# EAGLE design layout (EAGLE 7.5.0)
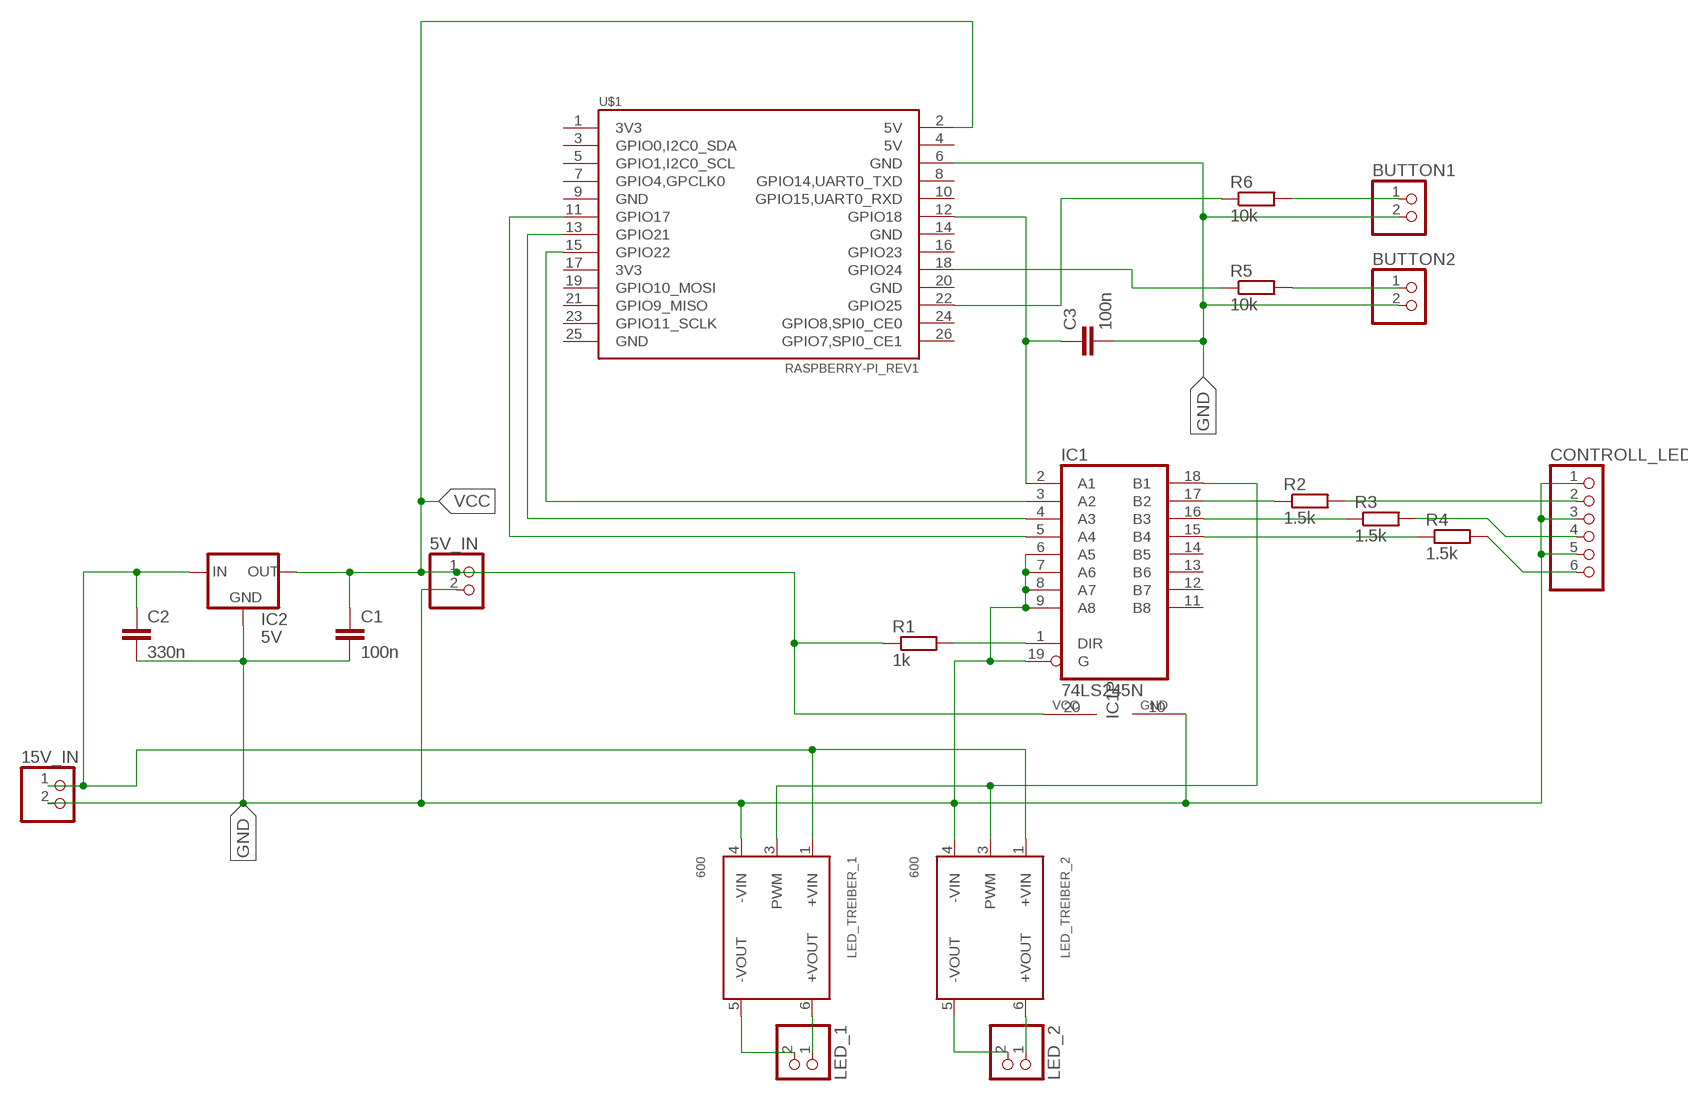
[diagram p0: schematic, sheet 1]

## Parts
5V_IN  PINHD-1X2  [1X02]
15V_IN  PINHD-1X2  [1X02]
BUTTON1  PINHD-1X2  [1X02]
BUTTON2  PINHD-1X2  [1X02]
C1  100n  C7.5/3  [C7.5B3]
C2  330n  C7.5/5  [C7.5B5]
C3  100n  C7.5/3  [C7.5B3]
CONTROLL_LED  PINHD-1X6  [1X06]
IC1  74LS245N  [DIL20]
IC2  5V  78XXS  [78XXS]
LED_1  PINHD-1X2  [1X02]
LED_2  PINHD-1X2  [1X02]
LED_TREIBER_1  600  LDD-L1  [LDD-L1]
LED_TREIBER_2  600  LDD-L1  [LDD-L1]
R1  1k  R-EU_0309/10  [0309/10]
R2  1.5k  R-EU_0309/10  [0309/10]
R3  1.5k  R-EU_0309/10  [0309/10]
R4  1.5k  R-EU_0309/10  [0309/10]
R5  10k  R-EU_0309/10  [0309/10]
R6  10k  R-EU_0309/10  [0309/10]
U$1  RASPBERRY-PI_REV1  [RASPBERRY-PI_REV1]

## Nets
GND: 5V_IN.2 15V_IN.2 BUTTON1.2 BUTTON2.2 C1.2 C2.2 C3.2 CONTROLL_LED.1 CONTROLL_LED.3 CONTROLL_LED.5 IC1.6(A5) IC1.7(A6) IC1.8(A7) IC1.9(A8) IC1.10(GND) IC1.19(G) IC2.GND LED_TREIBER_1.4(-VIN) LED_TREIBER_2.4(-VIN) U$1.6(GND)
N$1: LED_1.2 LED_TREIBER_1.5(-VOUT)
N$2: LED_1.1 LED_TREIBER_1.6(+VOUT)
N$3: LED_2.2 LED_TREIBER_2.5(-VOUT)
N$4: LED_2.1 LED_TREIBER_2.6(+VOUT)
N$5: IC1.1(DIR) R1.2
N$6: 15V_IN.1 C2.1 IC2.IN LED_TREIBER_1.1(+VIN) LED_TREIBER_2.1(+VIN)
N$7: IC1.18(B1) LED_TREIBER_1.3(PWM) LED_TREIBER_2.3(PWM)
N$8: C3.1 IC1.2(A1) U$1.12(GPIO18)
N$9: IC1.3(A2) U$1.15(GPIO22)
N$10: IC1.4(A3) U$1.13(GPIO21)
N$11: IC1.5(A4) U$1.11(GPIO17)
N$12: R5.1 U$1.18(GPIO24)
N$13: IC1.17(B2) R2.1
N$14: IC1.16(B3) R3.1
N$15: IC1.15(B4) R4.1
N$16: CONTROLL_LED.2 R2.2
N$17: CONTROLL_LED.4 R3.2
N$18: CONTROLL_LED.6 R4.2
N$19: R6.1 U$1.22(GPIO25)
N$20: BUTTON2.1 R5.2
N$21: BUTTON1.1 R6.2
VCC: 5V_IN.1 C1.1 IC1.20(VCC) IC2.OUT R1.1 U$1.2(5V)
Unconnected: IC1.11(B8) IC1.12(B7) IC1.13(B6) IC1.14(B5) U$1.1(3V3) U$1.3(GPIO0,I2C0_SDA) U$1.4(5V) U$1.5(GPIO1,I2C0_SCL) U$1.7(GPIO4,GPCLK0) U$1.8(GPIO14,UART0_TXD) U$1.9(GND) U$1.10(GPIO15,UART0_RXD) U$1.14(GND) U$1.16(GPIO23) U$1.17(3V3) U$1.19(GPIO10_MOSI) U$1.20(GND) U$1.21(GPIO9_MISO) U$1.23(GPIO11_SCLK) U$1.24(GPIO8,SPI0_CE0) U$1.25(GND) U$1.26(GPIO7,SPI0_CE1)

## Library data of the parts
5V_IN 15V_IN BUTTON1 BUTTON2 LED_1 LED_2 = pinhead:PINHD-1X2: PIN HEADER
C1-C3 = capacitor-wima:C: CAPACITOR naming: grid - package width
CONTROLL_LED = pinhead:PINHD-1X6: PIN HEADER
IC1 = adafruit:74*245: Octal BUS TRANSCEIVER, 3-state
IC2 = v-reg:78XXS: VOLTAGE REGULATOR
LED_TREIBER_1 LED_TREIBER_2 = meanwell_dcdc_v8:LDD-L1: LDD-L Constant Current: 300 - 700mA Vin : 9 - 36V Vout: 2 - 32V Cout: 300= 300mA 350= 350mA 500= 500mA 600= 600mA 700= 700mA PWM Frequency: 100Hz - 1KHz (5V / 1mA)
R1-R6 = resistor:R-EU_: RESISTOR, European symbol
U$1 = RaspberryPi:RASPBERRY-PI_REV1: Raspberry Pi Board <http://www.raspberrypi.org/> Jacques Lagnel V1.0 (beta) 2012 Mateusz Bawaj V1.1 (beta) 2012 Board dimension: Forum 3D model <http://www.raspberrypi.org/forum/general-discussion/mechanical-profile-3d-models?value=3d%20model&type=1&include=1&search=1&ret=all> The GPIO Connector (P1): http://elinux.org/RPi_Low-level_peripherals

## Board
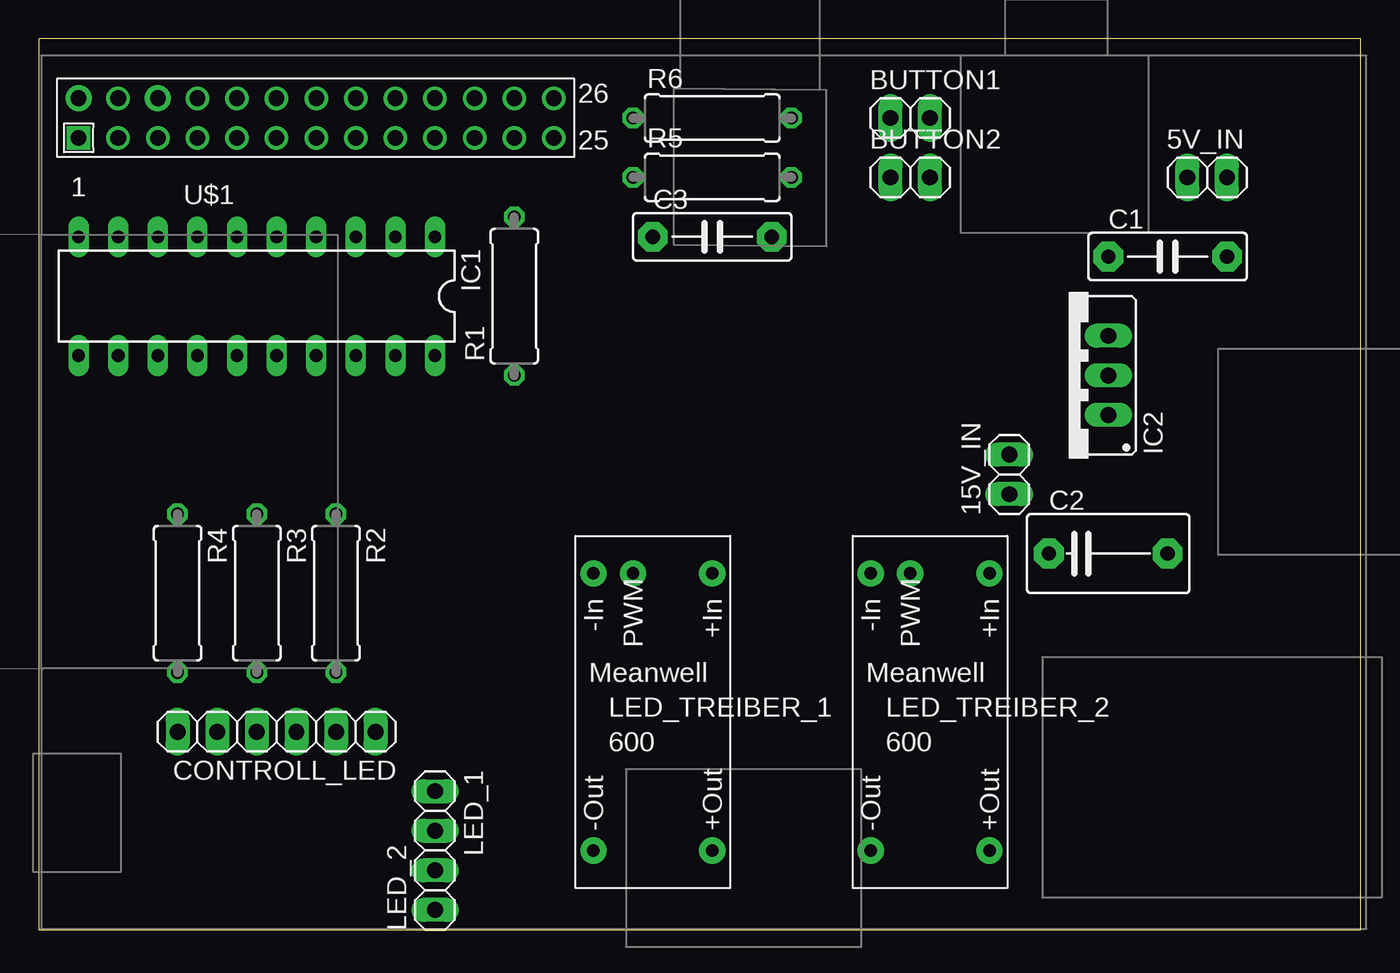
[diagram p1: board, top side]
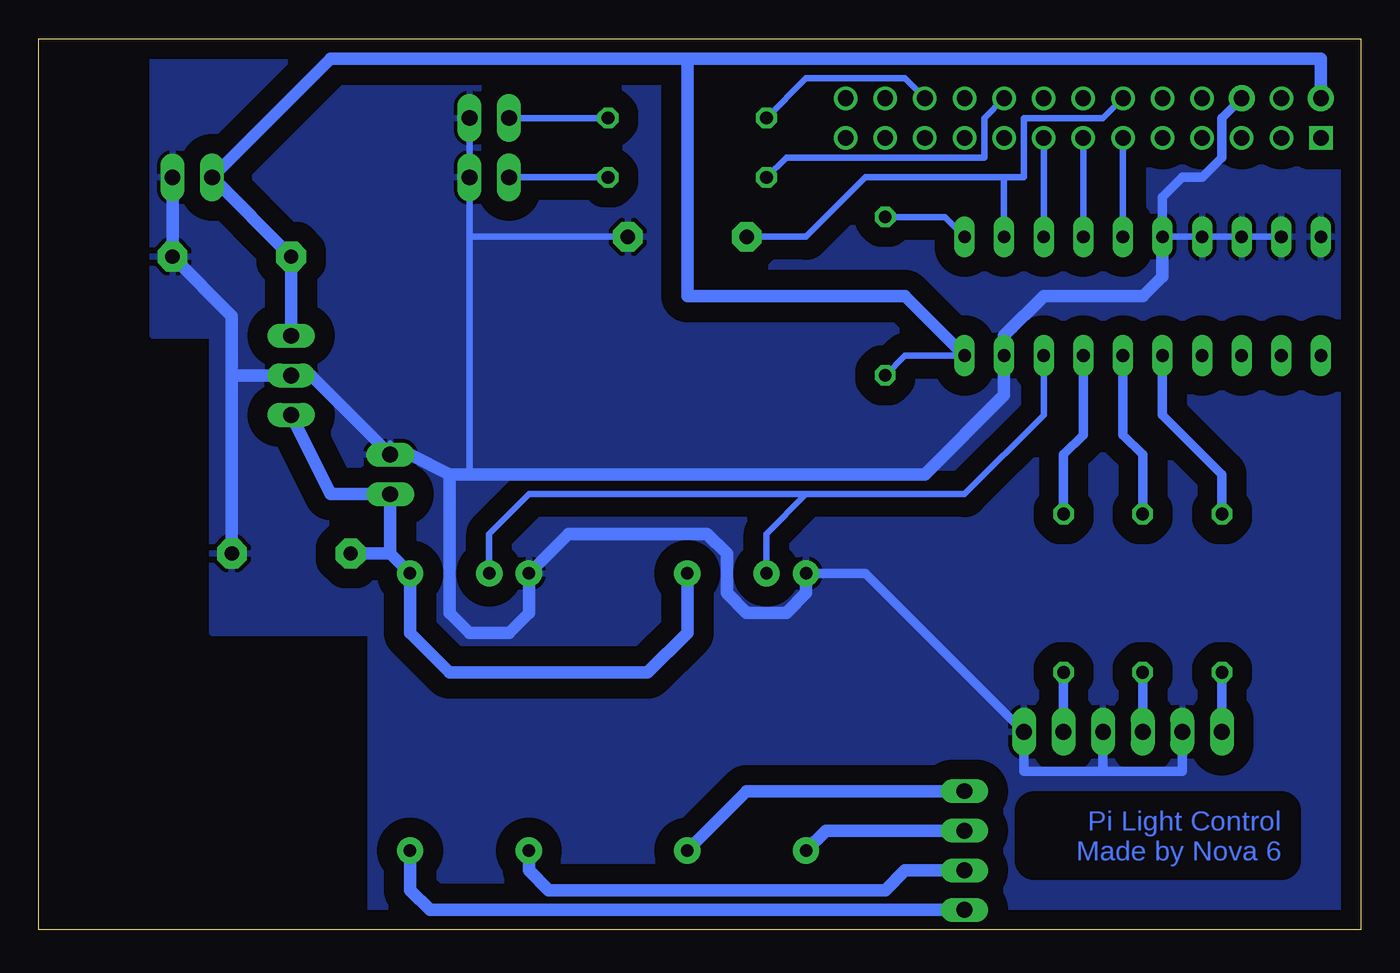
[diagram p2: board, bottom side, seen from below]

Size 84.76 x 57.14 mm. Coordinates in mm from the lower left corner, seen from the top.
Outline: 0,0 84.76,0 84.76,57.14 0,57.14 0,0
Copper layers (1*16): Top 0.035mm / dielectric 1.5mm / Bottom 0.035mm
Design rules "default": minimum track width 10mil, minimum drill 24mil, track to track 8mil, track to pad 8mil, pad to pad 8mil, via to via 8mil, smd to smd 8mil, copper to edge 40mil, drill to drill 8mil, minimum pad ring 10mil, minimum via ring 8mil, stop-mask expansion 4mil, vias tented up to drill 0mil, thermal gap 10mil

### Footprints (pad centres in the part's own frame; a part is rotated, then mirrored left to right if it is on the bottom)
1X02 = drill 1.016 long: 1 -1.27,0; 2 1.27,0
C7.5B3 = drill 0.914 pad 1.905 octagon: 1 -3.81,0; 2 3.81,0
C7.5B5 = drill 0.914 pad 1.905 octagon: 1 -3.81,0; 2 3.81,0
1X06 = drill 1.016 long: 1 -6.35,0; 2 -3.81,0; 3 -1.27,0; 4 1.27,0; 5 3.81,0; 6 6.35,0
DIL20 = drill 0.813 long: 1 -11.43,-3.81; 2 -8.89,-3.81; 3 -6.35,-3.81; 4 -3.81,-3.81; 5 -1.27,-3.81; 6 1.27,-3.81; 7 3.81,-3.81; 8 6.35,-3.81; 9 8.89,-3.81; 10 11.43,-3.81; 11 11.43,3.81; 12 8.89,3.81; 13 6.35,3.81; 14 3.81,3.81; 15 1.27,3.81; 16 -1.27,3.81; 17 -3.81,3.81; 18 -6.35,3.81; 19 -8.89,3.81; 20 -11.43,3.81
78XXS = drill 1.016 long: GND 0,-2.54; IN -2.54,-2.54; OUT 2.54,-2.54
LDD-L1 = drill 0.8 pad 1.676: 1 3.81,8.89; 3 -1.27,8.89; 4 -3.81,8.89; 5 -3.81,-8.89; 6 3.81,-8.89
0309/10 = drill 0.813 octagon: 1 -5.08,0; 2 5.08,0
RASPBERRY-PI_REV1 = drill 1 square: 1 -41.91,21.59 | drill 1 pad 1.676: 2 -41.91,24.13; 6 -36.83,24.13 | drill 1: 3 -39.37,21.59; 4 -39.37,24.13; 5 -36.83,21.59; 7 -34.29,21.59; 8 -34.29,24.13; 9 -31.75,21.59; 10 -31.75,24.13; 11 -29.21,21.59; 12 -29.21,24.13; 13 -26.67,21.59; 14 -26.67,24.13; 15 -24.13,21.59; 16 -24.13,24.13; 17 -21.59,21.59; 18 -21.59,24.13; 19 -19.05,21.59; 20 -19.05,24.13; 21 -16.51,21.59; 22 -16.51,24.13; 23 -13.97,21.59; 24 -13.97,24.13; 25 -11.43,21.59; 26 -11.43,24.13

### Placement (x,y rotation side)
5V_IN  74.93,48.26 0 top
15V_IN  62.23,29.21 90 top
BUTTON1  55.88,52.07 0 top
BUTTON2  55.88,48.26 0 top
C1  72.39,43.18 0 top
C2  68.58,24.13 0 top
C3  43.18,44.45 0 top
CONTROLL_LED  15.24,12.7 180 top
IC1  13.97,40.64 180 top
IC2  66.04,35.56 90 top
LED_1  25.4,7.62 270 top
LED_2  25.4,2.54 90 top
LED_TREIBER_1  39.37,13.97 0 top
LED_TREIBER_2  57.15,13.97 0 top
R1  30.48,40.64 90 top
R2  19.05,21.59 270 top
R3  13.97,21.59 270 top
R4  8.89,21.59 270 top
R5  43.18,48.26 0 top
R6  43.18,52.07 0 top
U$1  44.45,29.21 0 top

### Tracks (layer width: path | path; a pad name or v marks a point on that pad's centre or on a via)
GND
  Bottom 0.406: IC1.6 IC1.7 IC1.8 IC1.9 | BUTTON1.2 BUTTON2.2 57.15,44.45 | 62.23,31.19 15V_IN.2 | C3.2 57.15,44.45 | 57.15,44.45 57.15,29.21
  Bottom 0.61: 16.51,10.16 21.59,10.16 CONTROLL_LED.1 31.75,22.86 LED_TREIBER_1.4 | 16.51,10.16 CONTROLL_LED.3 | CONTROLL_LED.5 11.43,10.16 16.51,10.16 | U$1.6 8.89,52.07 8.89,49.53 10.16,48.26 11.43,48.26 12.7,46.99 IC1.6
  Bottom 0.813: 58.42,29.21 60.96,30.48 15V_IN.2 67.31,35.56 IC2.GND 72.39,35.56 | 72.39,35.56 C2.2 | 5V_IN.2 C1.2 72.39,39.37 72.39,35.56 | 58.42,29.21 57.15,29.21 27.94,29.21 22.86,34.29 IC1.19 22.86,38.1 20.32,40.64 13.97,40.64 12.7,41.91 IC1.6 | 58.42,29.21 58.42,20.32 57.15,19.05 54.61,19.05 53.34,20.32 LED_TREIBER_2.4 50.8,25.4 41.91,25.4 40.64,24.13 40.64,21.59 39.37,20.32 36.83,20.32 35.56,21.59 LED_TREIBER_1.4
  pour Bottom (isolate 1.27): 77.47,55.88 77.47,38.1 73.66,38.1 73.66,19.05 63.5,19.05 63.5,0 0,0 0,55.88
N$1
  Bottom 0.813: LED_TREIBER_1.5 34.29,6.35 LED_1.2
N$2
  Bottom 0.813: LED_TREIBER_1.6 39.37,8.89 LED_1.1
N$3
  Bottom 0.813: LED_2.2 29.21,3.81 30.48,2.54 52.07,2.54 53.34,3.81 LED_TREIBER_2.5
N$4
  Bottom 0.813: LED_TREIBER_2.6 60.96,2.54 59.69,1.27 LED_2.1
N$5
  Bottom 0.406: IC1.1 26.67,45.72 R1.2
N$6
  Bottom 0.813: 62.23,24.13 15V_IN.1 66.04,27.94 IC2.IN | 62.23,24.13 LED_TREIBER_2.1 60.96,19.05 58.42,16.51 45.72,16.51 43.18,19.05 LED_TREIBER_1.1 | C2.1 62.23,24.13
N$7
  Bottom 0.406: 35.56,27.94 25.4,27.94 20.32,33.02 IC1.18 | 35.56,27.94 53.34,27.94 55.88,25.4 LED_TREIBER_2.3 | LED_TREIBER_1.3 38.1,25.4 35.56,27.94
N$8
  Bottom 0.406: 22.86,48.26 IC1.2 | U$1.12 16.51,52.07 21.59,52.07 21.59,48.26 22.86,48.26 | 22.86,48.26 31.75,48.26 35.56,44.45 C3.1
N$9
  Bottom 0.406: U$1.15 IC1.3
N$10
  Bottom 0.406: U$1.13 IC1.4
N$11
  Bottom 0.406: U$1.11 IC1.5
N$12
  Bottom 0.406: R5.1 36.83,49.53 24.13,49.53 24.13,52.07 U$1.18
N$13
  Bottom 0.61: IC1.17 17.78,31.75 19.05,30.48 R2.1
N$14
  Bottom 0.61: IC1.16 15.24,31.75 13.97,30.48 R3.1
N$15
  Bottom 0.61: IC1.15 12.7,33.02 8.89,29.21 R4.1
N$16
  Bottom 0.61: R2.2 CONTROLL_LED.2
N$17
  Bottom 0.61: R3.2 CONTROLL_LED.4
N$18
  Bottom 0.61: R4.2 CONTROLL_LED.6
N$19
  Bottom 0.406: R6.1 35.56,54.61 29.21,54.61 U$1.22
N$20
  Bottom 0.406: R5.2 BUTTON2.1
N$21
  Bottom 0.406: BUTTON1.1 R6.2
VCC
  Bottom 0.406: R1.1 29.21,36.83 IC1.20
  Bottom 0.813: IC2.OUT C1.1 5V_IN.1 66.04,55.88 43.18,55.88 | U$1.2 2.54,55.88 43.18,55.88 | 43.18,55.88 43.18,40.64 29.21,40.64 IC1.20

### Text on the board
Bottom: Pi Light Control / Made by Nova 6